# Altium schematic sheet PocketAnalyzer_SwtBoardA_R00.SchDoc
size A4; SheetNumber: 2; SheetTotal: 3
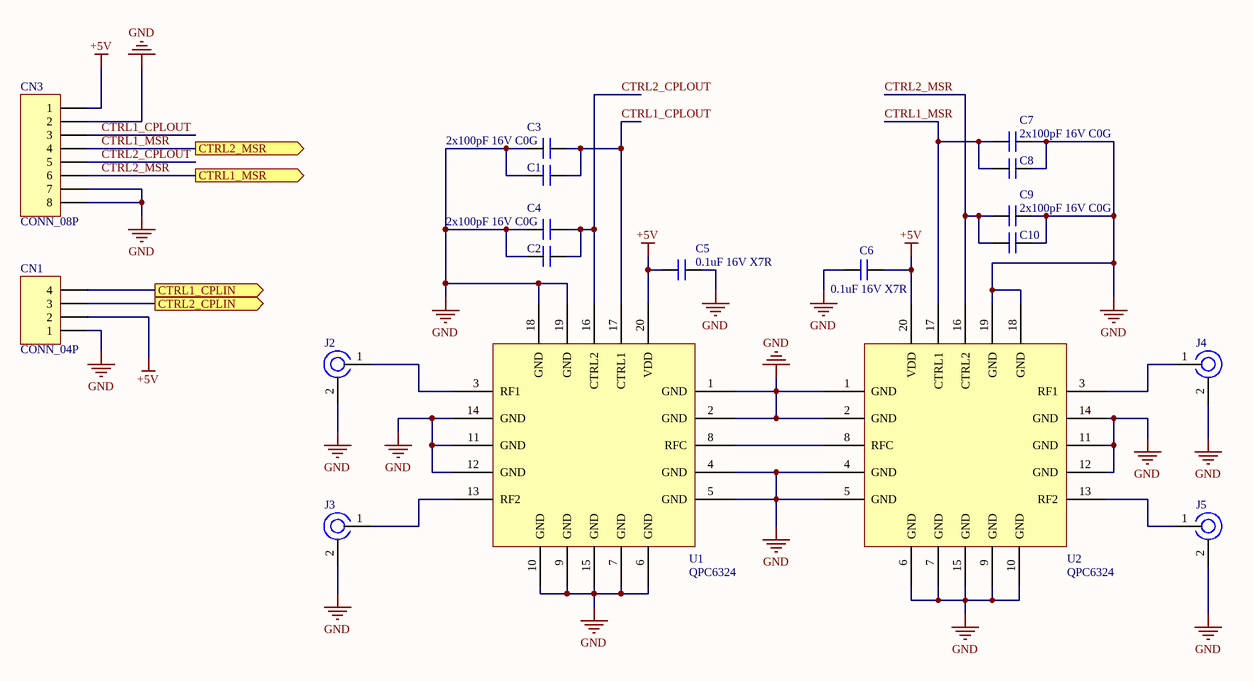
[diagram p0: PocketAnalyzer_SwtBoardA_R00.SchDoc]

## Parts
C1  200pF 16V C0G  [C_0805]  (value not drawn)
C2  2x100pF 16V C0G  [C_0805]  (value not drawn)
C3  2x100pF 16V C0G  [C_0805]
C4  2x100pF 16V C0G  [C_0805]
C5  0.1uF 16V X7R  [C_0805]
C6  0.1uF 16V X7R  [C_0805]
C7  2x100pF 16V C0G  [C_0805]
C8  2x100pF 16V C0G  [C_0805]  (value not drawn)
C9  2x100pF 16V C0G  [C_0805]
C10  2x100pF 16V C0G  [C_0805]  (value not drawn)
CN1  CONN_04P  [Header_M_2x2_0.1"]
CN3  CONN_08P  [Header_M_2x4_0.1"]
J2  SMA_Connector  [SMA_Connector]  (value not drawn)
J3  SMA_Connector  [SMA_Connector]  (value not drawn)
J4  SMA_Connector  [SMA_Connector]  (value not drawn)
J5  SMA_Connector  [SMA_Connector]  (value not drawn)
U1  QPC6324  [QFN50P400X400X90-21N-D]
U2  QPC6324  [QFN50P400X400X90-21N-D]

## Ports
CTRL1_CPLIN (out, see PocketAnalyzer_BLK_R00[2B], PocketAnalyzer_SwtBoardB_R00[3A]), CTRL1_MSR (out, see PocketAnalyzer_BLK_R00[2B], PocketAnalyzer_SwtBoardB_R00[2A]), CTRL2_CPLIN (out, see PocketAnalyzer_BLK_R00[2B], PocketAnalyzer_SwtBoardB_R00[3A]), CTRL2_MSR (out, see PocketAnalyzer_BLK_R00[2B], PocketAnalyzer_SwtBoardB_R00[2A])

## Nets
+5V: C5.1 C6.2 CN1.2 CN3.1 U1.20(VDD) U2.20(VDD)
GND: C1.1 C2.1 C3.1 C4.1 C5.2 C6.1 C7.2 C8.2 C9.2 C10.2 CN1.1 CN3.2 CN3.7 CN3.8 J2.2 J3.2 J4.2 J5.2 U1.1(GND) U1.2(GND) U1.4(GND) U1.5(GND) U1.6(GND) U1.7(GND) U1.9(GND) U1.10(GND) U1.11(GND) U1.12(GND) U1.14(GND) U1.15(GND) U1.18(GND) U1.19(GND) U2.1(GND) U2.2(GND) U2.4(GND) U2.5(GND) U2.6(GND) U2.7(GND) U2.9(GND) U2.10(GND) U2.11(GND) U2.12(GND) U2.14(GND) U2.15(GND) U2.18(GND) U2.19(GND)
CTRL1_CPLIN: CN1.4 ; port CTRL1_CPLIN
CTRL1_CPLOUT: C1.2 C3.2 CN3.3 U1.17(CTRL1)
CTRL1_MSR: C7.1 C8.1 CN3.4 U2.17(CTRL1) ; port CTRL2_MSR
CTRL2_CPLIN: CN1.3 ; port CTRL2_CPLIN
CTRL2_CPLOUT: C2.2 C4.2 CN3.5 U1.16(CTRL2)
CTRL2_MSR: C9.1 C10.1 CN3.6 U2.16(CTRL2) ; port CTRL1_MSR
NetJ2_1: J2.1 U1.3(RF1)
NetJ3_1: J3.1 U1.13(RF2)
NetJ4_1: J4.1 U2.3(RF1)
NetJ5_1: J5.1 U2.13(RF2)
NetU1_8: U1.8(RFC) U2.8(RFC)

## Library data of the parts
C1-C10 = Ceramic Cap
CN1 = CONN_04P: Connector Generic 4 Vias
CN3 = CONN_08P: Connector Generic 8 Vias
J2-J5 = SMA_Connector: Connector SMA
U1 U2 = QPC6324: SPDT RF Switch